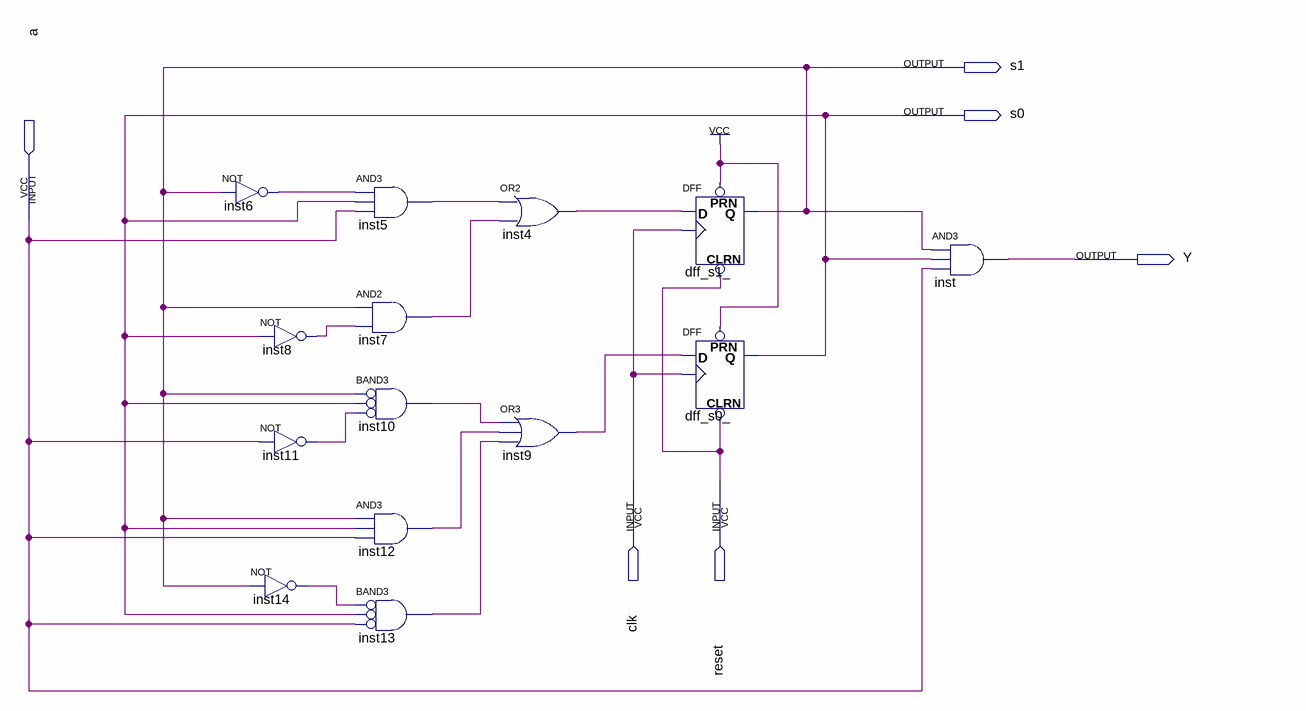
[diagram p0: schematic sheet]
// Quartus schematic BinarySimulation.bdf as structural Verilog: 14 symbols, 6 pins
module BinarySimulation (
  input  a,
  input  clk,
  input  reset,
  output s1,
  output s0,
  output Y
);

  wire inst4_out, inst5_out, inst6_out, inst7_out, inst8_out, inst9_out, inst10_out, inst11_out, inst12_out,
       inst13_out, inst14_out;

  not inst6 (inst6_out, s1);
  not inst8 (inst8_out, s0);
  not inst11 (inst11_out, a);
  not inst14 (inst14_out, s1);
  and inst5 (inst5_out, inst6_out, s0, a);
  and inst7 (inst7_out, s1, inst8_out);
  and inst10 (inst10_out, ~s1, ~s0, ~inst11_out);  // BAND3
  and inst12 (inst12_out, s1, s0, a);
  and inst13 (inst13_out, ~inst14_out, ~s0, ~a);  // BAND3
  or inst4 (inst4_out, inst5_out, inst7_out);
  or inst9 (inst9_out, inst10_out, inst12_out, inst13_out);
  DFF dff_s1_ (.CLRN(reset), .CLK(clk), .D(inst4_out), .PRN(1'b1), .Q(s1));
  DFF dff_s0_ (.CLRN(reset), .CLK(clk), .D(inst9_out), .PRN(1'b1), .Q(s0));
  and inst (Y, s1, s0, a);
endmodule
